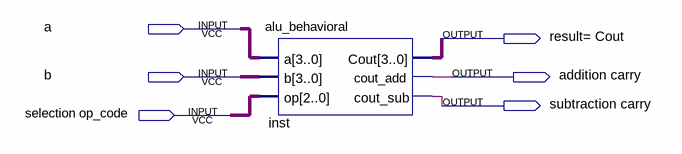
[diagram p0: schematic sheet]
// Quartus schematic alu_behavioral_block.bdf as structural Verilog: 1 symbols, 6 pins
module alu_behavioral_block (
  input  a,
  input  b,
  input  \selection_op_code ,
  output \result=_Cout ,
  output \addition_carry ,
  output \subtraction_carry 
);

  wire [2:0] undriven_3;
  wire [3:0] inst_cout, undriven, undriven_2;

  alu_behavioral inst (
    .a(undriven), .b(undriven_2), .op(undriven_3), .Cout(inst_cout), .cout_add(\addition_carry ),
    .cout_sub(\subtraction_carry ));
endmodule
